# EAGLE design garatea-board (EAGLE 8.1.0)
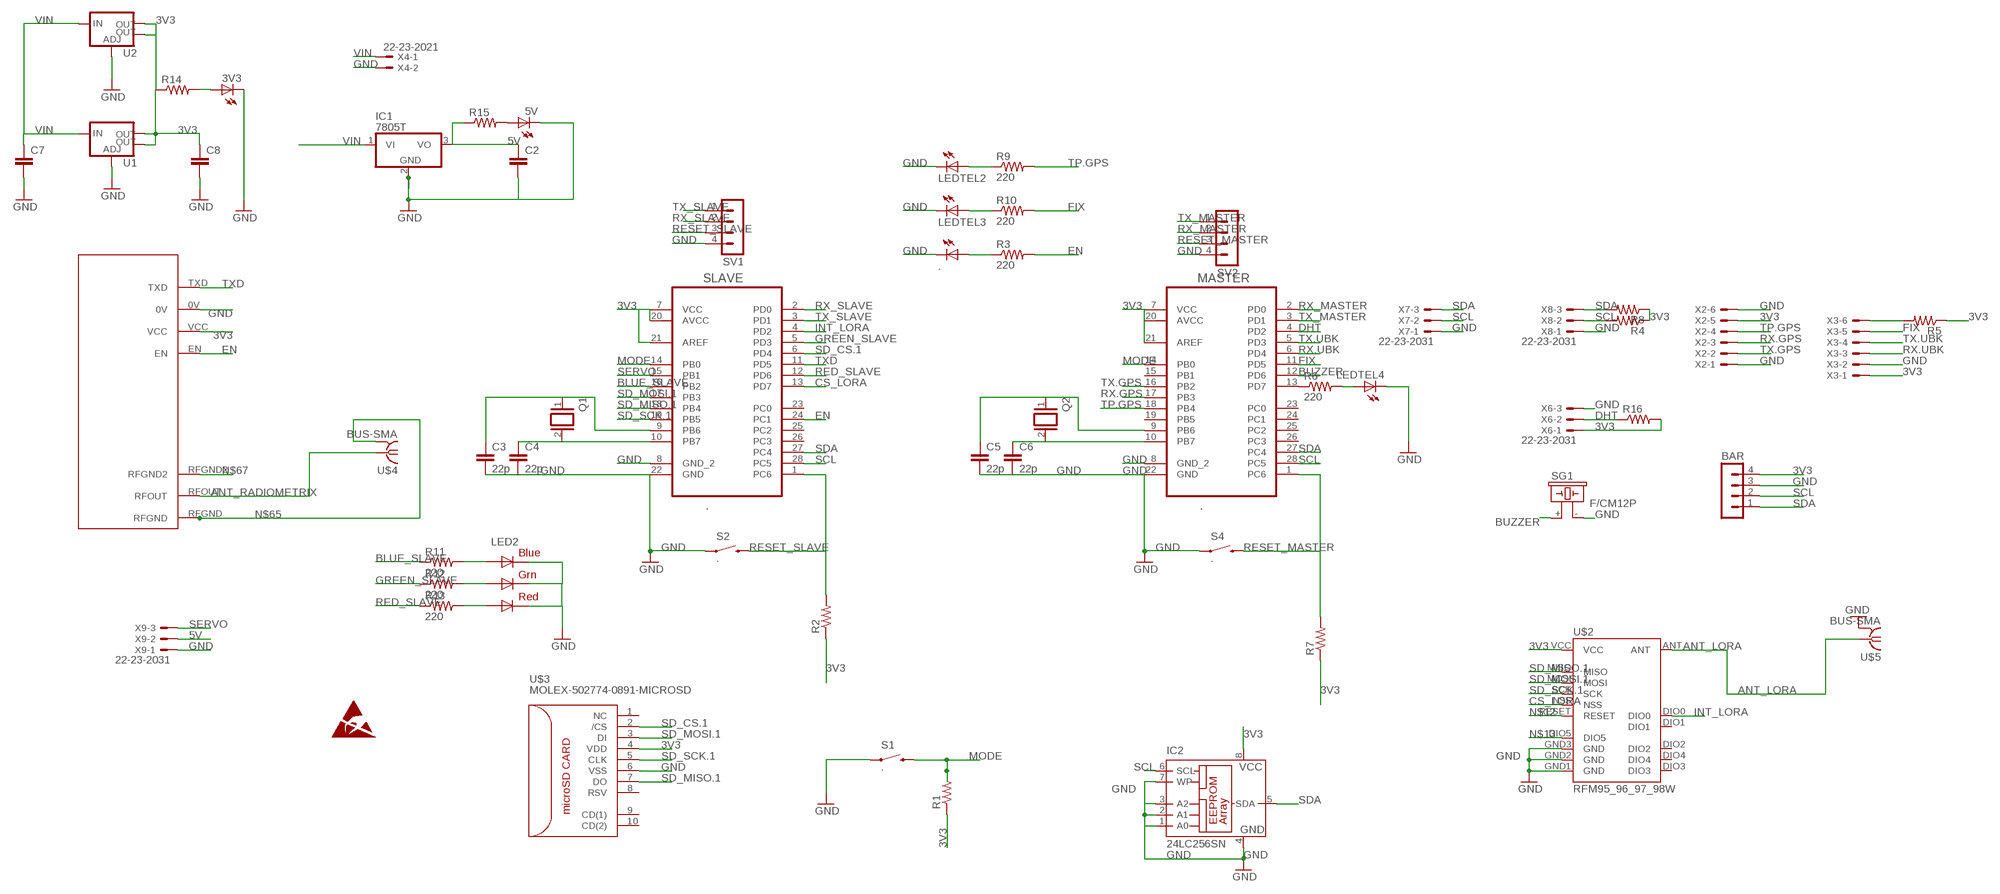
[diagram p0: schematic, sheet 1]

## Parts
3V3  LEDSMT1206  [1206]
5V  LEDSMT1206  [1206]
.  LEDSMT1206  [1206]
BAR  MA04-1  [MA04-1]
C2  10UF-1210-50V-20%  [1210]
C3  22p  22UF-1210-16V-20%  [1210]
C4  22p  10UF-1210-50V-20%  [1210]
C5  22p  10UF-1210-50V-20%  [1210]
C6  22p  10UF-1210-50V-20%  [1210]
C7  10UF-1210-50V-20%  [1210]
C8  10UF-1210-50V-20%  [1210]
IC1  7805T  [TO220H]
IC2  24LC256SN  [SO-08]
LED2  RGBLED5050  [RGBLED5050]
LEDTEL2  LEDSMT1206  [1206]
LEDTEL3  LEDSMT1206  [1206]
LEDTEL4  LEDSMT1206  [1206]
MASTER  .  ATMEGA328P-PU  [DIP254P762X457-28]
Q1  XTAL/S  [QS]
Q2  XTAL/S  [QS]
R1  R-US_M1206  [M1206]
R2  R-US_M1206  [M1206]
R3  220  R-US_M1206  [M1206]
R4  R-US_M1206  [M1206]
R5  R-US_M1206  [M1206]
R6  220  R-US_M1206  [M1206]
R7  R-US_M1206  [M1206]
R8  R-US_M1206  [M1206]
R9  220  R-US_M1206  [M1206]
R10  220  R-US_M1206  [M1206]
R11  220  R-US_M1206  [M1206]
R12  220  R-US_M1206  [M1206]
R13  220  R-US_M1206  [M1206]
R14  R-US_M1206  [M1206]
R15  R-US_M1206  [M1206]
R16  R-US_M1206  [M1206]
S1  .  SWITCH-MOMENTARY-2SMD-1101NE  [TACTILE-SWITCH-1101NE]
S2  .  SWITCH-MOMENTARY-2SMD-1101NE  [TACTILE-SWITCH-1101NE]
S4  .  SWITCH-MOMENTARY-2SMD-1101NE  [TACTILE-SWITCH-1101NE]
SG1  F/CM12P  [F/CM12P]
SLAVE  .  ATMEGA328P-PU  [DIP254P762X457-28]
SV1  MA04-1  [MA04-1]
SV2  MA04-1  [MA04-1]
U1  V_REG_LM1117SOT223  [SOT223]
U2  V_REG_LM1117SOT223  [SOT223]
U$1  NTX2  [NTX2]
U$2  RFM95_96_97_98W  [RFM95_96_97_98W]
U$3  MOLEX-502774-0891-MICROSD  [MOLEX-502774-0891-MICROSD]
U$4  BUS-SMA  [BUS-SMA]
U$5  BUS-SMA  [BUS-SMA]
X2  22-23-2061  [22-23-2061]
X3  22-23-2061  [22-23-2061]
X4  22-23-2021  [22-23-2021]
X6  22-23-2031  [22-23-2031]
X7  22-23-2031  [22-23-2031]
X8  22-23-2031  [22-23-2031]
X9  22-23-2031  [22-23-2031]

## Nets
3V3: BAR.4 C8.1 IC2.8(VCC) MASTER.7(VCC) MASTER.20(AVCC) MASTER.21(AREF) R1.1 R2.1 R4.1 R5.1 R7.1 R8.1 R14.1 R16.2 SLAVE.7(VCC) SLAVE.20(AVCC) SLAVE.21(AREF) U1.2(OUT) U1.4(OUT) U2.2(OUT) U2.4(OUT) U$1.VCC U$2.VCC U$3.4(VDD) X2.5 X3.1 X6.1
5V: C2.1 IC1.3(VO) R15.1 X9.2
ANT_LORA: U$2.ANT U$5.1
ANT_RADIOMETRIX: U$1.RFOUT U$4.1
BLUE_SLAVE: R11.1 SLAVE.16(PB2)
BUZZER: MASTER.12(PD6) SG1.+
CS_LORA: SLAVE.13(PD7) U$2.NSS
DHT: MASTER.4(PD2) R16.1 X6.2
EN: R3.2 SLAVE.24(PC1) U$1.EN
EN.UBK: R5.2 X3.6
FIX: MASTER.11(PD5) R10.2 X3.5
GND: 3V3.C 5V.C ..C BAR.3 C2.2 C3.2 C4.2 C5.2 C6.2 C7.2 C8.2 IC1.2(GND) IC2.1(A0) IC2.2(A1) IC2.3(A2) IC2.4(GND) IC2.7(WP) LED2.4(BLUE_C) LED2.5(RED_C) LED2.6(GREEN_C) LEDTEL2.C LEDTEL3.C LEDTEL4.C MASTER.8(GND_2) MASTER.22(GND) S1.1 S2.1 S4.1 SG1.- SLAVE.8(GND_2) SLAVE.22(GND) SV1.4 SV2.4 U1.1(ADJ) U2.1(ADJ) U$1.0V U$2.GND1(GND) U$2.GND2(GND) U$2.GND3(GND) U$3.6(VSS) U$5.2(GND) U$5.3(GND) U$5.4(GND) U$5.5(GND) X2.1 X2.6 X3.2 X4.2 X6.3 X7.1 X8.1 X9.1
GREEN_SLAVE: R12.1 SLAVE.5(PD3)
INT_LORA: SLAVE.4(PD2) U$2.DIO0
MODE: MASTER.14(PB0) R1.2 S1.2 SLAVE.14(PB0)
N$1: MASTER.13(PD7) R6.1
N$2: LEDTEL3.A R10.1
N$3: LEDTEL2.A R9.1
N$4: ..A R3.1
N$5: 5V.A R15.2
N$6: LED2.3(BLUE_A) R11.2
N$7: LED2.1(GREEN_A) R12.2
N$8: LED2.2(RED_A) R13.2
N$9: 3V3.A R14.2
N$10: C6.1 MASTER.10(PB7) Q2.2
N$11: LEDTEL4.A R6.2
N$12: U$2.RESET
N$13: U$2.DIO5
N$23: C3.1 Q1.1 SLAVE.9(PB6)
N$24: C4.1 Q1.2 SLAVE.10(PB7)
N$25: C5.1 MASTER.9(PB6) Q2.1
N$65: U$1.RFGND U$4.2(GND) U$4.3(GND) U$4.4(GND) U$4.5(GND)
N$67: U$1.RFGND2
RED_SLAVE: R13.1 SLAVE.12(PD6)
RESET_MASTER: MASTER.1(PC6) R7.2 S4.2 SV2.3
RESET_SLAVE: R2.2 S2.2 SLAVE.1(PC6) SV1.3
RX.GPS: MASTER.17(PB3) X2.3
RX.UBK: MASTER.6(PD4) X3.3
RX_MASTER: MASTER.2(PD0) SV2.2
RX_SLAVE: SLAVE.2(PD0) SV1.2
SCL: BAR.2 IC2.6(SCL) MASTER.28(PC5) R4.2 SLAVE.28(PC5) X7.2 X8.2
SD_CS.1: SLAVE.6(PD4) U$3.2(/CS)
SD_MISO.1: SLAVE.18(PB4) U$2.MISO U$3.7(DO)
SD_MOSI.1: SLAVE.17(PB3) U$2.MOSI U$3.3(DI)
SD_SCK.1: SLAVE.19(PB5) U$2.SCK U$3.5(CLK)
SDA: BAR.1 IC2.5(SDA) MASTER.27(PC4) R8.2 SLAVE.27(PC4) X7.3 X8.3
SERVO: SLAVE.15(PB1) X9.3
TP.GPS: MASTER.18(PB4) R9.2 X2.4
TX.GPS: MASTER.16(PB2) X2.2
TX.UBK: MASTER.5(PD3) X3.4
TX_MASTER: MASTER.3(PD1) SV2.1
TX_SLAVE: SLAVE.3(PD1) SV1.1
TXD: SLAVE.11(PD5) U$1.TXD
VIN: C7.1 IC1.1(VI) U1.3(IN) U2.3(IN) X4.1
Unconnected: MASTER.15(PB1) MASTER.19(PB5) MASTER.23(PC0) MASTER.24(PC1) MASTER.25(PC2) MASTER.26(PC3) SLAVE.23(PC0) SLAVE.25(PC2) SLAVE.26(PC3) U$2.DIO1 U$2.DIO2 U$2.DIO3 U$2.DIO4 U$3.1(NC) U$3.8(RSV) U$3.9(CD(1)) U$3.10(CD(2))

## Library data of the parts
3V3 5V . LEDTEL2-LEDTEL4 = adafruit:LED: LED OSRAM: - CHIPLED LG R971, LG N971, LY N971, LG Q971, LY Q971, LO R971, LY R971 LH N974, LH R974 LS Q976, LO Q976, LY Q976 LO Q996 - Hyper CHIPLED LW Q18S LB Q993, LB Q99A, LB R99A - SideLED LS A670, LO A670, LY A670, LG A670, LP A670 LB A673, LV A673, LT A673, LW A673 LH A674 LY A675 LS A676, LA A676, LO A676, LY A676, LW A676 LS A679, LY A679, LG A679 - Hyper Micro SIDELED® LS Y876, LA Y876, LO Y876, LY Y876 LT Y87S - SmartLED LW L88C, LW L88S LB L89C, LB L89S, LG L890 LS L89K, LO L89K, LY L89K LS L896, LA L896, LO L896, LY L896 - TOPLED LS T670, LO T670, LY T670, LG T670, LP T670 LSG T670, LSP T670, LSY T670, LOP T670, LYG T670 LG T671, LOG T671, LSG T671 LB T673, LV T673, LT T673, LW T673 LH T674 LS T676, LA T676, LO T676, LY T676, LB T676, LH T676, LSB T676, LW T676 LB T67C, LV T67C, LT T67C, LS T67K, LO T67K, LY T67K, LW E67C LS E67B, LA E67B, LO E67B, LY E67B, LB E67C, LV E67C, LT E67C LW T67C LS T679, LY T679, LG T679 LS T770, LO T770, LY T770, LG T770, LP T770 LB T773, LV T773, LT T773, LW T773 LH T774 LS E675, LA E675, LY E675, LS T675 LS T776, LA T776, LO T776, LY T776, LB T776 LHGB T686 LT T68C, LB T68C - Hyper Mini TOPLED® LB M676 - Mini TOPLED Santana® LG M470 LS M47K, LO M47K, LY M47K Source: http://www.osram.convergy.de/
BAR SV1 SV2 = con-lstb:MA04-1: PIN HEADER; OC_FARNELL: unknown; OC_NEWARK: unknown
C2 C4-C8 = SparkFun-Capacitors:10UF: 10.0µF ceramic capacitors A capacitor is a passive two-terminal electrical component used to store electrical energy temporarily in an electric field.; PROD_ID: CAP-09824; VALUE: 10uF
C3 = SparkFun-Capacitors:22UF: 22µF ceramic capacitors A capacitor is a passive two-terminal electrical component used to store electrical energy temporarily in an electric field.
IC1 = adafruit:78*: Positive VOLTAGE REGULATOR Added bigger pads to the TO-92 package
IC2 = microchip:24*: Serial EEPROM I2C; MF: MICROCHIP; MPN: 24LC256-I/SN; OC_FARNELL: 9757996; OC_NEWARK: 27C9144
LED2 = adafruit:RGBLED: For 5050 RGB LEDs, the order of the LEDs may vary from one manufacturer to another!
MASTER SLAVE = Atmel_By_element14_Batch_1-00:ATMEGA328P-PU: 8-bit Microcontroller with In-System Programmable Flash; MPN: ATMEGA328P-PU; OC_FARNELL: 1715487; OC_NEWARK: 15R0268; PACKAGE: PDIP-28; SUPPLIER: Atmel
Q1 Q2 = special:XTAL/S: CRYSTAL
R1-R16 = adafruit:R-US_: RESISTOR, American symbol
S1 S2 S4 = SparkFun-Electromechanical:SWITCH-MOMENTARY-2: Various NO switches- pushbuttons, reed, etc; PROD_ID: SWCH-00815
SG1 = buzzer:F/CM12P: BUZZER Source: Buerklin; OC_FARNELL: unknown; OC_NEWARK: unknown
U1 = SparkFun-IC-Power:V_REG_LM1117: Voltage Regulator LM1117 Standard adjustable voltage regulator but in SMD form. Spark Fun Electronics SKU : COM-00595; PROD_ID: VREG-08170
U2 = SparkFun-PowerIC:V_REG_LM1117: Voltage Regulator LM1117 Standard adjustable voltage regulator but in SMD form. Spark Fun Electronics SKU : COM-00595; PROD_ID: VREG-08170
U$1 = Ava:NTX2: Radiometrix NTX2 Transmitter Module Author Anthony Stirk / http://ava.upuaut.net
U$2 = Ava:RFM95_96_97_98W
U$3 = Ava:MOLEX-502774-0891-MICROSD; FARNELL: 2064063
U$4 U$5 = Ava:BUS-SMA
X2 X3 = con-molex:22-23-2061: .100" (2.54mm) Center Header - 6 Pin; MF: MOLEX; MPN: 22-23-2061; OC_FARNELL: 1462922; OC_NEWARK: 27C1933
X4 = con-molex:22-23-2021: .100" (2.54mm) Center Header - 2 Pin; MF: MOLEX; MPN: 22-23-2021; OC_FARNELL: 1462926; OC_NEWARK: 25C3832
X6-X9 = con-molex:22-23-2031: .100" (2.54mm) Center Header - 3 Pin; MF: MOLEX; MPN: 22-23-2031; OC_FARNELL: 1462950; OC_NEWARK: 30C0862

## Board
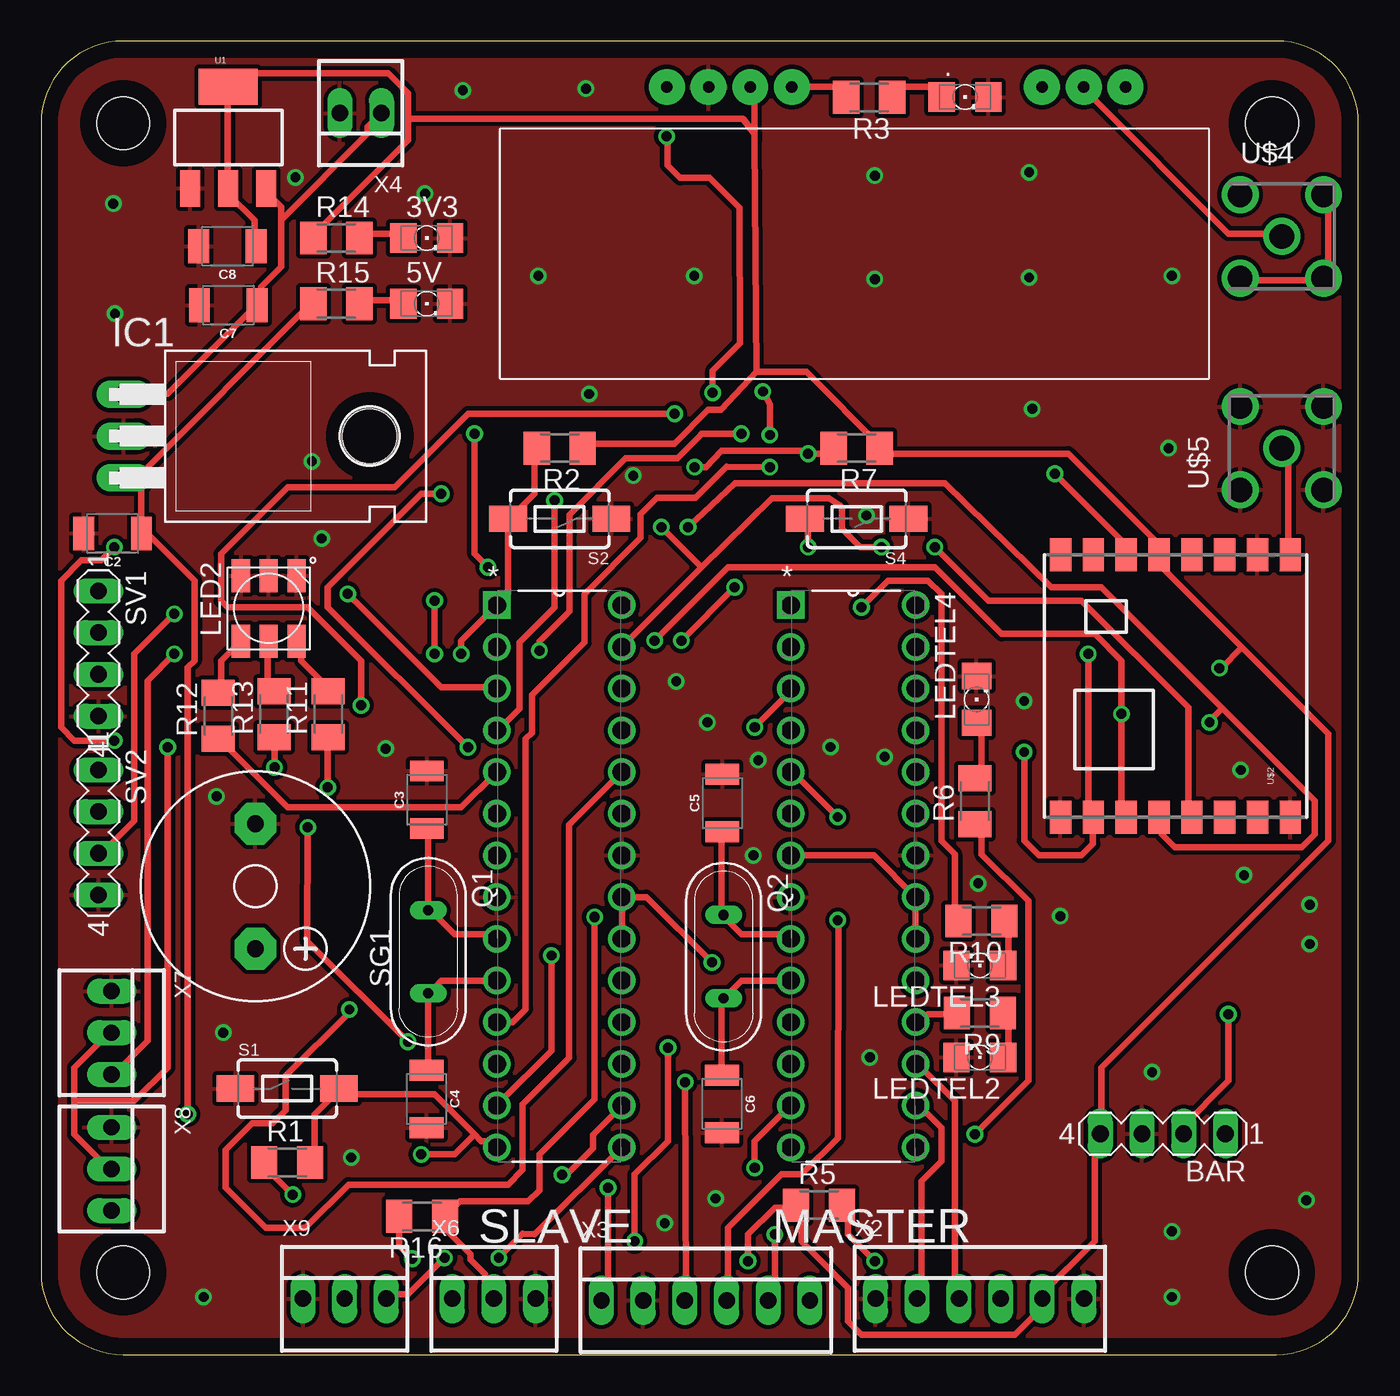
[diagram p1: board, top side]
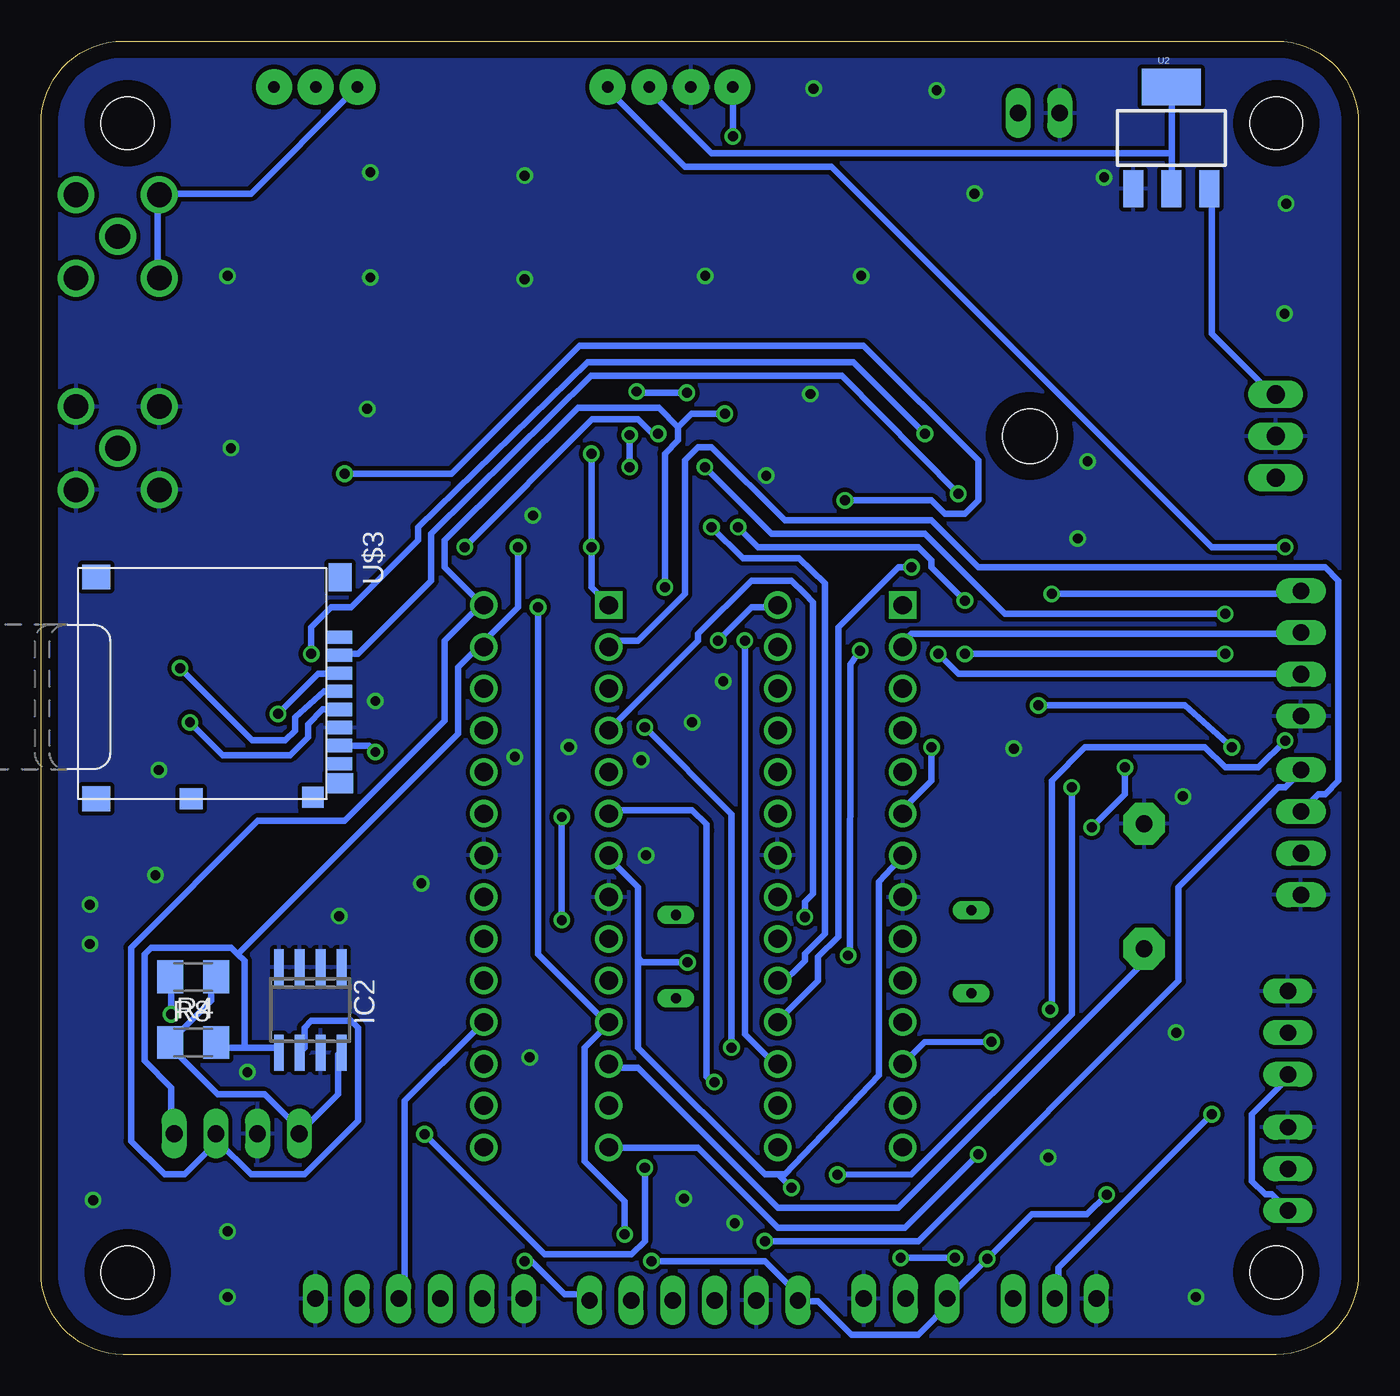
[diagram p2: board, bottom side, seen from below]

Size 80.27 x 80 mm. Coordinates in mm from the lower left corner, seen from the top.
Outline: 5,0 75.27,0 arc90 80.27,5 80.27,75 arc90 75.27,80 5,80 arc90 0,75 0,5 arc90 5,0
Copper layers (1*16): Top 0.035mm / dielectric 1.5mm / Bottom 0.035mm
Design rules "default *": minimum track width 16mil, minimum drill 24mil, track to track 10mil, track to pad 10mil, pad to pad 8mil, via to via 8mil, smd to smd 8mil, copper to edge 40mil, drill to drill 8mil, minimum pad ring 10mil, minimum via ring 8mil, stop-mask expansion 4mil, vias tented up to drill 100mil, thermal gap 10mil
Holes 3.2 mm at 5,5 5,75 75,75 75,5

### Footprints (pad centres in the part's own frame; a part is rotated, then mirrored left to right if it is on the bottom)
1206 = smd 1.6 x 1.803: A -1.422,0; C 1.422,0
MA04-1 = drill 1.016 long: 1 -3.81,0; 2 -1.27,0; 3 1.27,0; 4 3.81,0
1210 = smd 1.27 x 2.06: 1 -1.755,0; 2 1.755,0
TO220H = drill 1.118 long: 1 -2.54,-10.16; 2 0,-10.16; 3 2.54,-10.16 | hole 3.302: 0,4.826
SO-08 = smd 0.6 x 2.2: 1 -1.905,-2.6; 2 -0.635,-2.6; 3 0.635,-2.6; 4 1.905,-2.6; 5 1.905,2.6; 6 0.635,2.6; 7 -0.635,2.6; 8 -1.905,2.6
RGBLED5050 = smd 2 x 1.1: 1 -2,1.7; 2 -2,0; 3 -2,-1.7; 4 2,-1.7; 5 2,0; 6 2,1.7
DIP254P762X457-28 = drill 1.118 square: 1 -7.62,33.02 | drill 1.118: 2 -7.62,30.48; 3 -7.62,27.94; 4 -7.62,25.4; 5 -7.62,22.86; 6 -7.62,20.32; 7 -7.62,17.78; 8 -7.62,15.24; 9 -7.62,12.7; 10 -7.62,10.16; 11 -7.62,7.62; 12 -7.62,5.08; 13 -7.62,2.54; 14 -7.62,0; 15 0,0; 16 0,2.54; 17 0,5.08; 18 0,7.62; 19 0,10.16; 20 0,12.7; 21 0,15.24; 22 0,17.78; 23 0,20.32; 24 0,22.86; 25 0,25.4; 26 0,27.94; 27 0,30.48; 28 0,33.02
QS = drill 0.61 long: 1 -2.54,0; 2 2.54,0
M1206 = smd 1.6 x 2: 1 -1.4,0; 2 1.4,0
TACTILE-SWITCH-1101NE = smd 2.3 x 1.6: 1 -3.15,0; 2 3.15,0
F/CM12P = drill 1.016 pad 2.54 octagon: + 3.81,0; - -3.81,0
SOT223 = smd 1.219 x 2.235: 1 -2.311,-3.099; 2 0,-3.099; 3 2.311,-3.099 | smd 3.6 x 2.2: 4 0,3.099
NTX2 = drill 0.7 pad 2.184: 0V -2.54,-10.16; EN -7.62,-10.16; RFGND -22.86,-10.16; RFGND2 -27.94,-10.16; RFOUT -25.4,-10.16; TXD 0,-10.16; VCC -5.08,-10.16
RFM95_96_97_98W = smd 2 x 1.3: ANT 8,-7; DIO0 8,3; DIO1 8,5; DIO2 8,7; DIO3 8,-3; DIO4 8,-1; DIO5 -8,-5; GND1 -8,7; GND2 8,-5; GND3 -8,-7; MISO -8,5; MOSI -8,3; NSS -8,-1; RESET -8,-3; SCK -8,1; VCC 8,1
MOLEX-502774-0891-MICROSD = smd 0.8 x 1.5: 1 -3.3,8.2; 2 -2.2,8.2; 3 -1.1,8.2; 4 0,8.2; 5 1.1,8.2; 6 2.2,8.2; 7 3.3,8.2; 8 4.4,8.2 | smd 1.29 x 1.3: 9 6.455,6.55 | smd 1.29 x 1.4: 10 6.54,-0.85 | smd 1.5 x 1.7: 11 6.54,-6.65; 12 -6.96,-6.65 | smd 1.7 x 1.4: 14 -6.96,8.2 | smd 1.2 x 1.6: 15 5.6,8.2
BUS-SMA = drill 1.5: 1 0,0; 2 -2.54,2.54; 3 2.54,2.54; 4 2.54,-2.54; 5 -2.54,-2.54
22-23-2061 = drill 1 long: 1 -6.35,0; 2 -3.81,0; 3 -1.27,0; 4 1.27,0; 5 3.81,0; 6 6.35,0
22-23-2021 = drill 1 long: 1 -1.27,0; 2 1.27,0
22-23-2031 = drill 1 long: 1 -2.54,0; 2 0,0; 3 2.54,0

### Placement (x,y rotation side)
3V3  23.5,68 0 top
5V  23.5,64 0 top
.  56.3,76.59 0 top
BAR  68.35,13.45 180 top
C2  4.36,50.01 180 top
C3  [1210]  23.51,33.79 90 top
C4  [1210]  23.49,15.56 270 top
C5  [1210]  41.51,33.59 90 top
C6  [1210]  41.49,15.26 270 top
C7  11.41,63.91 180 top
C8  11.36,67.51 180 top
IC1  15.2,55.94 270 top
IC2  63.87,20.98 180 bottom
LED2  13.88,45.44 90 top
LEDTEL2  57.2,18.1 180 top
LEDTEL3  57.2,23.7 180 top
LEDTEL4  57,39.9 90 top
MASTER  53.29,12.62 0 top
Q1  23.59,24.53 270 top
Q2  41.59,24.23 270 top
R1  15,11.7 0 top
R2  31.6,55.2 180 top
R3  [M1206]  50.46,76.57 180 top
R4  71,23 180 bottom
R5  47.4,9.1 0 top
R6  [M1206]  56.9,33.7 90 top
R7  49.7,55.2 180 top
R8  71,19 0 bottom
R9  [M1206]  57.2,20.8 180 top
R10  [M1206]  57.3,26.4 180 top
R11  [M1206]  17.5,39 90 top
R12  [M1206]  10.8,38.9 90 top
R13  [M1206]  14.2,39 90 top
R14  18,68 0 top
R15  18,64 0 top
R16  23.22,8.41 180 top
S1  15,16.2 0 top
S2  31.6,50.9 180 top
S4  49.7,50.9 180 top
SG1  13.06,28.52 270 top
SLAVE  35.39,12.62 0 top
SV1  3.5,42.7 270 top
SV2  3.5,31.8 270 top
U1  11.41,74.12 0 top
U2  11.4,74.1 0 bottom
U$1  38.13,67.04 180 top
U$2  69.12,40.72 90 top
U$3  70.26,40.39 270 bottom
U$4  75.6,68.1 0 top
U$5  75.6,55.2 90 top
X2  57.2,3.4 0 top
X3  40.5,3.3 0 top
X4  19.47,75.61 180 top
X6  27.6,3.4 0 top
X7  4.3,19.6 270 top
X8  4.3,11.3 270 top
X9  18.5,3.4 0 top

### Tracks (layer width: path | path; a pad name or v marks a point on that pad's centre or on a via)
3V3  (via drill 0.6, 0.61)
  Top 0.406: v34.54,10.16 34.54,3.66 X3.1 | C8.1 13.01,67.87 13.01,69.09 11.38,70.71 U1.2 11.38,71.12 11.38,77.22 U1.4 11.79,77.62 12.19,78.03 21.13,78.03 22.35,76.81 22.35,75.15 | 22.35,75.15 22.35,73.97 16.66,68.28 R14.1 | R2.1 33.36,55.46 38.58,55.46 40.63,57.53 41.43,57.53 43.58,59.85 | 43.58,59.85 43.48,73.97 43.48,74.36 | 43.48,74.36 43.48,76.81 U$1.VCC | 73.17,43.06 67.87,48.36 U$2.VCC 67.87,48.77 67.87,49.58 62.59,54.86 51.21,54.86 R7.1 51.21,55.27 46.62,59.85 43.58,59.85 | 73.17,43.06 78.44,37.8 78.44,31.29 64.62,17.48 64.62,13.82 BAR.4 64.21,13.41 64.21,6.91 60.96,3.66 X2.5 61.37,3.25 59.33,1.22 49.99,1.22 49.17,2.03 49.17,4.06 46.33,6.91 46.33,8.94 R5.1 45.92,8.94 44.7,8.94 43.08,7.32 v43.08,5.69 | v71.8,41.8 71.9,41.8 73.17,43.06 | MASTER.7 50.75,30.4 MASTER.21 MASTER.20 | SLAVE.20 SLAVE.21 36.89,27.86 v40.88,23.89 | 43.48,74.36 42.77,75.27 22.43,75.27 22.35,75.15 | v15.34,9.73 13.6,11.47 R1.1 | R16.2 21.82,6.63 v22.62,5.83
  Bottom 0.406: 35.36,10.97 36.17,10.97 43.89,18.69 43.89,24.17 | 35.36,10.97 34.95,10.97 29.21,17.02 29.21,28.81 28.04,30.07 SLAVE.7 | 43.89,24.17 43.89,28.45 45.52,30.07 MASTER.7 | 35.36,10.97 v34.54,10.16 | R4.1 69.9,22.76 69.9,21.54 72.34,19.1 R8.1 72.34,18.69 69.49,15.85 66.65,15.85 64.62,13.82 BAR.4 64.21,13.82 62.18,15.85 62.18,18.29 IC2.8 | 11.38,73.15 11.38,76.81 U2.4 | U2.2 11.38,71.12 11.38,73.15 | U$1.VCC 43.08,76.81 39.42,73.15 11.38,73.15 | v43.08,5.69 36.17,5.69 34.54,4.06 34.54,3.66 X3.1 34.14,3.25 32.92,3.25 30.89,1.22 26.82,1.22 24.79,3.25 X6.1 24.79,3.66 v22.62,5.83 19.91,8.53 16.54,8.53 v15.34,9.73 | U$3.4 63.01,40.39 64.8,38.8 64.8,38 65.4,37.4 67.4,37.4 v71.8,41.8 | v40.88,23.89 43.68,23.89 43.89,24.17
5V  (via drill 0.61)
  Top 0.406: 6.1,53.65 16.26,63.8 R15.1 | 6.1,53.65 5.28,53.65 IC1.3 6.1,53.65 | 6.1,53.65 6.1,50.39 C2.1 6.5,49.99 9.35,47.14 9.35,42.27 8.94,41.86 v8.94,14.63
  Bottom 0.406: v8.94,14.63 18.29,5.28 18.29,3.66 X9.2
ANT_LORA
  Top 0.406: U$2.ANT 76,48.77 76,54.86 U$5.1
ANT_RADIOMETRIX
  Top 0.406: U$1.RFOUT 63.8,76.81 72.34,68.28 75.59,68.28 U$4.1
BLUE_SLAVE  (via drill 0.61)
  Top 0.406: v17.48,34.54 17.48,37.39 R11.1 | 35.36,15.04 SLAVE.16 33.62,13.39 33.62,12.55 32.02,10.95 v31.75,10.95
  Bottom 0.406: v17.48,34.54 17.48,20.73 27.23,10.97 v31.75,10.95
BUZZER
  Bottom 0.406: MASTER.12 45.52,17.48 43.89,17.48 35.36,8.94 28.04,8.94 13.41,23.57 13.41,24.38 SG1.+
CS_LORA  (via drill 0.6, 0.61)
  Top 0.406: v54.46,49.17 57.71,45.92 63.4,45.92 69.9,39.42 69.9,32.92 U$2.NSS | v42.67,56.08 40.23,56.08 40.23,56.05 38.77,54.58 35.62,54.58 32.19,51.15 32.19,45.26 30.37,43.44 v30.37,42.87 | SLAVE.13 28.04,15.44 31.1,18.5 v31.1,24.3
  Bottom 0.406: v54.46,49.17 46.71,56.98 43.91,56.98 43,56.06 v42.67,56.08 | v30.37,42.87 30.96,42.05 30.96,40.65 30.97,24.75 v31.1,24.3
DHT  (via drill 0.61)
  Top 0.406: 27.64,3.25 X6.2 27.05,3.95 27.05,4.9 26.18,5.77 26.18,6.12 24.62,7.67 R16.1 25.54,9.34 29.68,9.34 30.37,10.02 30.37,12.19 33.73,15.56 v33.73,26.65
  Bottom 0.406: v33.73,26.65 33.73,27.57 33.24,28.06 33.24,45.81 33.73,46.33 34.54,47.14 36.98,47.14 40.23,43.89 40.23,43.48 45.52,38.2 MASTER.4
EN  (via drill 0.6, 0.61)
  Top 0.406: R3.2 48.77,77.22 45.92,77.22 U$1.EN | v4.47,37.39 2.03,37.39 1.22,38.2 1.22,47.14 2.44,48.36 3.66,48.36 v4.47,49.17 | v18.78,21.01 18.78,20.8 14.92,16.97 14.92,14.88 14.12,14.08 12.86,14.08 11.24,12.46 11.24,10.17 13.7,7.71 16.1,7.71 18.73,10.34 28.44,10.34 29.34,11.24 29.34,15.24 32.17,18.08 32.17,32.27 SLAVE.24
  Bottom 0.406: v4.47,37.39 6.1,35.76 8.13,35.76 9.35,36.98 16.66,36.98 18.69,34.95 18.69,20.96 v18.78,21.01 | v4.47,49.17 8.94,49.17 32.11,72.34 41.05,72.34 45.52,76.81 U$1.EN
EN.UBK  (via drill 0.61)
  Top 0.406: v50.8,5.69 49.17,7.32 49.17,8.94 R5.2
  Bottom 0.406: v50.8,5.69 50.39,5.69 48.36,3.66 47.14,3.66 X3.6
FIX  (via drill 0.61)
  Top 0.406: v49.99,45.52 51.61,47.14 54.05,47.14 54.86,46.33 54.86,31.29 55.68,30.48 55.68,26.42 R10.2 | v44.7,7.32 44.7,3.66 X3.5
  Bottom 0.406: v49.99,45.52 49.99,24.38 45.92,20.32 MASTER.11 45.92,19.91 47.14,18.69 47.14,11.79 44.7,9.35 v44.7,7.32
GND  (via drill 0.6)
  Top 0.406: 15.44,47.51 15.44,47.55 LED2.4
  other vias: 10.7,34 21,36.9 36.08,53.53 33.4,58.5 15.5,71.7 23.4,70.7 59.9,39.8 62.1,26.7 73.3,29.2 73.1,35.6 50.3,51.1 43.4,30.4 43.7,36.2 17.1,49.7 16.5,54.4 11.1,19.6 18.9,12 41.1,9.5 38,8 40.6,38.5 38.7,41 57.1,28.7 67.7,17.2 4.4,70.1 4.5,63.4 25.7,77 33.2,77.1 30.3,65.7 39.8,65.7 50.8,65.5 50.8,71.8 60.2,72 60.2,65.6 68.9,65.7 60.4,57.6 68.7,55.2 77.3,25 77.3,27.4 77.1,9.4 68.9,7.5 68.9,3.5 9.9,3.5 48.1,37 51.4,36.4 50.5,18.1
  pour Bottom: 75,0 5.03,0 arc-90 0.23,5.03 0.47,75.03 arc-90 5.47,80 75,80 arc-90 80,75 80,5 arc-90
  pour Top: 0.2,5 0,75 arc-90 5,80 75,80 arc-90 80,75 80,5 arc-90 75,0 5,0 arc-90
GREEN_SLAVE
  Top 0.406: R12.1 10.97,37.39 15.04,33.33 25.6,33.33 27.64,35.36 SLAVE.5
INT_LORA  (via drill 0.61)
  Top 0.406: v61.77,53.65 65.84,49.58 65.84,48.77 U$2.DIO0 | v31.29,52.02 31.29,45.51 29.16,43.38 29.16,39.32 28.04,38.2 SLAVE.4
  Bottom 0.406: v61.77,53.65 55.27,53.65 47.47,61.45 30.15,61.45 23.16,54.46 23.16,52.02 23.98,51.21 25.2,51.21 26.01,52.02 v31.29,52.02
MODE  (via drill 0.61)
  Top 0.406: R1.2 16.66,11.79 16.66,14.63 17.88,15.85 S1.2 18.29,15.85 23.98,15.85 26.42,13.41 | 26.42,13.41 26.82,13.01 27.64,13.01 SLAVE.14 | v23.16,12.19 25.2,12.19 26.42,13.41
  Bottom 0.406: v23.16,12.19 27.64,7.72 35.36,7.72 40.23,12.6 45.52,12.6 MASTER.14
N$1  (via drill 0.61)
  Top 0.406: v56.9,13.41 60.15,16.66 60.15,27.64 57.3,30.48 57.3,32.11 R6.1 | v43.48,11.38 43.48,13.01 45.52,15.04 MASTER.13
  Bottom 0.406: v56.9,13.41 49.58,6.1 44.3,6.1 43.48,6.91 v43.48,11.38
N$2
  Top 0.406: LEDTEL3.A 58.93,23.98 58.93,26.01 R10.1
N$3
  Top 0.406: LEDTEL2.A 58.93,18.29 58.93,20.73 R9.1
N$4
  Top 0.406: ..A 54.86,77.22 52.02,77.22 R3.1
N$5
  Top 0.406: 5V.A 21.95,64.21 19.51,64.21 R15.2
N$6
  Top 0.406: LED2.3 15.85,43.08 15.85,42.27 17.48,40.64 R11.2
N$7
  Top 0.406: R12.2 10.97,40.64 10.97,42.27 11.79,43.08 LED2.1
N$8
  Top 0.406: LED2.2 13.82,43.08 13.82,40.64 R13.2
N$9
  Top 0.406: 3V3.A 21.95,68.28 19.51,68.28 R14.2
N$10
  Top 0.406: C6.1 41.45,17.07 41.45,21.54 Q2.2 41.86,21.95 42.67,22.76 45.52,22.76 MASTER.10
N$11
  Top 0.406: LEDTEL4.A 57.3,38.2 57.3,35.36 R6.2
N$23
  Top 0.406: C3.1 23.57,31.7 23.57,27.23 Q1.1 23.98,26.82 25.2,25.6 27.64,25.6 SLAVE.9
N$24
  Top 0.406: C4.1 23.57,17.48 23.57,21.95 Q1.2 23.98,22.35 24.38,22.76 27.64,22.76 SLAVE.10
N$25
  Top 0.406: C5.1 41.45,31.7 41.45,26.82 Q2.1 41.86,26.42 42.67,25.6 45.52,25.6 MASTER.9
N$65
  Top 0.406: U$4.3 78.44,70.31 78.44,65.84 U$4.4 78.03,65.43 73.15,65.43 U$4.5
  Bottom 0.406: U$1.RFGND 61.37,76.81 67.46,70.71 72.75,70.71 U$4.2 73.15,70.31 73.15,65.84 U$4.5
RED_SLAVE  (via drill 0.61)
  Top 0.406: v14.22,35.76 14.22,37.39 R13.1 | v16.26,32.11 16.22,25.17 v22.36,19.05
  Bottom 0.406: v14.22,35.76 14.22,34.14 v16.26,32.11 | 27.64,17.88 SLAVE.12 26.44,19.03 v22.36,19.05
RESET_MASTER  (via drill 0.61)
  Top 0.406: R7.2 47.95,54.86 v46.74,54.86 46.89,55.03 41.47,55.03 40.51,54.05 v39.83,54.05 | v46.74,49.17 46.74,50.8 S4.2 | v8.13,45.11 5.69,42.67 5.69,32.51 4.06,30.89 3.66,30.89 SV2.3
  Bottom 0.406: v46.74,54.86 v46.74,49.17 46.74,46.74 45.92,45.92 MASTER.1 | v8.13,45.11 21.54,45.11 26.42,49.99 35.76,49.99 v39.83,54.05
RESET_SLAVE  (via drill 0.61)
  Top 0.406: R2.2 30.07,54.86 30.07,52.43 28.85,51.21 S2.2 28.45,50.8 28.45,46.33 28.04,45.92 SLAVE.1 27.64,45.52 25.6,43.48 v25.6,42.67
  Bottom 0.406: v25.6,42.67 24.38,41.45 3.66,41.45 SV1.3
RX.GPS
  Top 0.406: X2.3 55.68,3.66 55.68,15.44 53.65,17.48 MASTER.17
RX.UBK  (via drill 0.6)
  Top 0.406: v39.24,16.59 v39.25,16.59 39.29,3.68 X3.3
  Bottom 0.406: v39.24,16.59 39.72,16.92 39.72,31.91 39.74,31.91 39.74,32.29 40.6,33.15 45.46,33.15 MASTER.6
RX_MASTER
  Bottom 0.406: SV2.2 3.25,33.33 2.44,34.14 2.03,34.14 1.22,34.95 1.22,47.14 2.03,47.95 23.16,47.95 26.01,50.8 34.95,50.8 39.42,55.27 40.23,55.27 41.05,54.46 41.05,46.33 43.89,43.48 45.52,43.48 MASTER.2
RX_SLAVE
  Bottom 0.406: SV1.2 3.66,43.89 27.23,43.89 27.64,43.48 SLAVE.2
SCL  (via drill 0.61)
  Top 0.406: v72.34,20.73 72.34,16.66 69.49,13.82 BAR.2 | 2.03,15.44 2.03,17.48 4.06,19.51 X7.2 | 2.03,15.44 2.03,13.41 4.06,11.38 X8.2 | v42.27,46.74 v39.01,43.48 | 2.03,15.44 5.69,15.44 7.72,17.48 v7.72,36.98 | v19.51,39.53 19.51,42.27 16.26,45.52 11.38,45.52 10.97,45.92 10.97,48.77 15.04,52.83 21.54,52.83 26.01,57.3 v38.61,57.3
  Bottom 0.406: v72.34,20.73 72.34,22.76 R4.2 | 69.49,13.01 69.9,13.41 BAR.2 69.49,13.01 | 69.49,13.01 67.46,10.97 64.21,10.97 60.96,14.22 60.96,19.91 61.37,20.32 63.8,20.32 64.21,19.91 64.21,18.69 IC2.6 | v39.01,43.48 36.98,45.52 35.76,45.52 SLAVE.28 | v42.27,46.74 42.27,54.86 41.45,55.68 41.45,56.49 | 41.45,56.49 42.63,57.66 47.54,57.66 55.68,49.58 55.68,47.95 53.65,45.92 MASTER.28 53.65,45.52 55.68,43.48 55.68,38.61 61.77,32.51 67.06,32.51 74.78,24.79 74.78,13.01 72.75,10.97 71.53,10.97 69.49,13.01 | v7.72,36.98 10.57,39.53 v19.51,39.53 | v38.61,57.3 40.64,57.3 41.45,56.49
SD_CS.1  (via drill 0.61)
  Top 0.406: v24.38,52.43 23.16,52.43 17.48,46.74 17.48,45.52 v26.01,36.98
  Bottom 0.406: v24.38,52.43 31.48,59.62 46.76,59.62 56.49,49.99 56.49,47.14 60.96,42.67 61.77,42.67 U$3.2 | v26.01,36.98 26.01,34.95 27.64,33.33 SLAVE.6
SD_MISO.1  (via drill 0.6, 0.61)
  Top 0.406: v63.8,42.67 63.8,32.92 U$2.MISO 64.1,32.7 64.1,31.1 63.4,30.4 60.8,30.4 59.9,31.3 v59.9,36.7 | v26.42,56.08 26.42,48.77 v27.23,47.95
  Bottom 0.406: v63.8,42.67 63.8,44.3 62.59,45.52 61.37,45.52 57.3,49.58 57.3,50.39 46.96,60.43 30.77,60.43 v26.42,56.08 | v27.23,47.95 28.04,47.95 31.7,44.3 31.7,25.43 32.92,24.22 32.92,22.76 35.36,20.32 SLAVE.18 | U$3.7 60.29,37.09 v59.9,36.7
SD_MOSI.1  (via drill 0.61)
  Top 0.406: U$2.MOSI 65.84,32.92 v65.84,39.01 65.84,42.27 64.21,43.89 58.52,43.89 54.46,47.95 41.86,47.95 v37.39,43.48
  Bottom 0.406: v65.84,39.01 63.4,41.45 62.18,41.45 U$3.3 | v37.39,43.48 37.39,19.51 35.76,17.88 SLAVE.17
SD_SCK.1  (via drill 0.6, 0.61)
  Top 0.406: 71.98,39.38 64.62,46.74 61.55,46.74 55.06,53.07 42.28,53.07 v39.42,50.39 | 71.98,39.38 77.62,33.73 77.62,31.7 76.81,30.89 69.09,30.89 68.28,31.7 68.28,32.51 U$2.SCK | v71.2,38.5 71.2,38.6 71.98,39.38
  Bottom 0.406: v39.42,50.39 37.52,48.51 34.08,48.51 32.51,46.98 32.51,25.64 33.73,24.42 33.73,23.99 35.36,22.36 SLAVE.19 | U$3.5 63.11,39.29 64,38.4 64,37.6 65.1,36.5 69.2,36.5 v71.2,38.5
SDA  (via drill 0.61)
  Top 0.406: 40.23,47.95 44.53,52.16 48.01,52.16 48.7,51.7 48.8,51.6 48.8,50.3 49.93,49.17 v51.21,49.17 | 40.23,47.95 35.76,43.48 SLAVE.27 | v8.13,42.67 6.5,41.05 6.5,19.1 4.47,17.07 X7.3 | v23.98,45.92 v23.98,42.67 | 40.23,47.95 v37.8,50.39
  Bottom 0.406: 67.87,18.69 65.84,18.69 IC2.5 | 67.87,18.69 69.49,18.69 R8.2 | 68.28,24.38 67.87,23.98 67.87,18.69 | 68.28,24.38 68.68,24.79 73.56,24.79 73.97,24.38 73.97,17.88 72.34,16.26 72.34,13.82 BAR.1 | X8.3 4.47,8.94 5.28,9.75 5.69,9.75 6.5,10.57 6.5,14.63 4.47,16.66 X7.3 | v51.21,49.17 51.21,45.52 53.24,43.48 MASTER.27 53.65,43.08 54.86,41.86 54.86,37.8 68.28,24.38 | v23.98,42.67 v8.13,42.67 | v23.98,45.92 26.01,47.95 26.01,48.36 26.82,49.17 36.58,49.17 v37.8,50.39
SERVO  (via drill 0.6)
  Top 0.406: X9.3 21.13,3.66 22.35,3.66 v24.58,5.89 | SLAVE.15 35.36,12.6 30.07,7.32 29.34,7.35 v27.89,5.89
  Bottom 0.406: v27.89,5.89 v24.58,5.89
TP.GPS
  Top 0.406: R9.2 55.68,20.73 54.05,20.73 53.65,20.32 MASTER.18
  Bottom 0.406: X2.4 58.12,3.66 58.12,15.44 53.65,19.91 MASTER.18
TX.GPS
  Top 0.406: X2.2 53.65,3.66 53.65,10.57 54.86,11.79 54.86,13.82 53.65,15.04 MASTER.16
TX.UBK  (via drill 0.6)
  Top 0.406: v48.54,26.46 48.6,26.3 48.54,13.19 46.33,10.97 45.11,10.97 41.86,7.72 41.86,3.66 X3.4 | v48.54,32.74 45.92,35.36 MASTER.5
  Bottom 0.406: v48.54,32.74 v48.54,26.46
TX_MASTER  (via drill 0.61)
  Top 0.406: v36.17,6.91 36.17,10.97 38.2,13.01 v38.2,18.69 | v43.48,38.2 45.52,40.23 MASTER.3
  Bottom 0.406: v36.17,6.91 26.82,6.91 10.97,22.76 10.97,28.45 4.88,34.54 4.47,34.54 3.66,35.36 SV2.1 | v38.2,18.69 38.2,32.92 v43.48,38.2
TX_SLAVE  (via drill 0.61)
  Top 0.406: v18.69,46.33 24.38,40.64 27.64,40.64 SLAVE.3
  Bottom 0.406: v18.69,46.33 3.66,46.33 SV1.1
TXD  (via drill 0.6)
  Top 0.406: SLAVE.11 28.74,20.24 29.53,21.03 29.53,37.49 29.91,37.87 29.91,40.18 33.11,43.38 33.11,46.31 36.54,49.74 36.54,51.19 37.53,52.18 39.87,52.18 41.78,54.08 v44.41,54.05 44.46,54.08 | v44.41,56.01 44.42,57.89 v43.99,58.66 | v40.92,58.58 40.92,59.93 42.58,61.59 42.56,69.69 42.56,69.84 40.73,71.67 38.94,71.67 38.16,72.45 38.16,74.05 v38.12,74.2 38.14,74.07
  Bottom 0.406: v44.41,54.05 v44.41,56.01 | v38.12,74.2 38.12,77.19 U$1.TXD | v40.92,58.58 43.91,58.58 v43.99,58.66
VIN
  Top 0.406: 14.63,69.09 14.63,69.9 13.82,70.71 U1.3 | 14.63,69.09 14.63,66.24 13.41,65.02 13.41,64.21 C7.1 13.01,63.8 7.72,58.52 5.28,58.52 IC1.1 | 14.63,69.09 19.91,74.37 19.91,74.78 20.73,75.59 X4.1
  Bottom 0.406: U2.3 8.94,70.71 8.94,62.18 5.28,58.52 IC1.1

### Text on the board
Name: ZENITH 2017 | STRATOLINK v2.0
125bmp: TEL | 3v3 | 5v | FIX 1 | MODE | FIX 2 | BAR